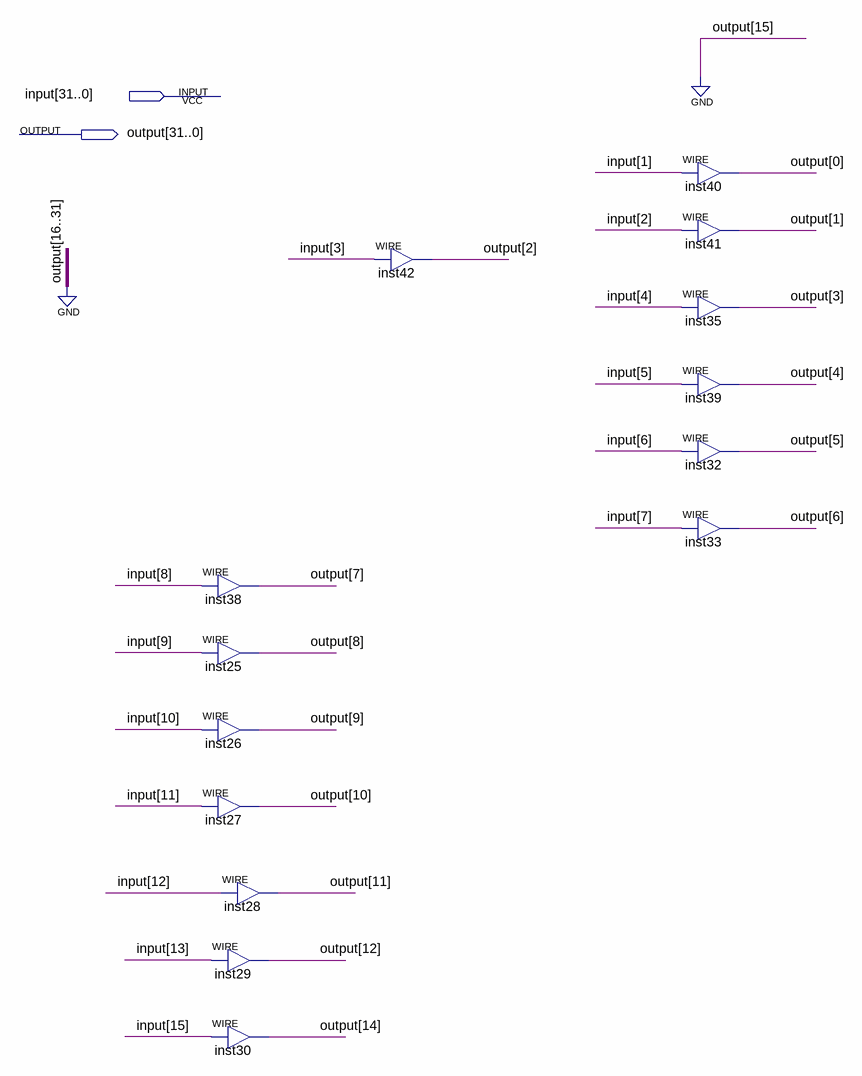
[diagram p0: schematic sheet]
// Quartus schematic 16-shiftR.bdf as structural Verilog: 14 symbols, 2 pins
module \16-shiftR  (
  input  [31:0] \input ,
  output [31:0] \output 
);

  assign \output [7] = \input [8];  // WIRE inst38
  assign \output [8] = \input [9];  // WIRE inst25
  assign \output [9] = \input [10];  // WIRE inst26
  assign \output [10] = \input [11];  // WIRE inst27
  assign \output [11] = \input [12];  // WIRE inst28
  assign \output [12] = \input [13];  // WIRE inst29
  assign \output [14] = \input [15];  // WIRE inst30
  assign \output [2] = \input [3];  // WIRE inst42
  assign \output [0] = \input [1];  // WIRE inst40
  assign \output [1] = \input [2];  // WIRE inst41
  assign \output [3] = \input [4];  // WIRE inst35
  assign \output [4] = \input [5];  // WIRE inst39
  assign \output [5] = \input [6];  // WIRE inst32
  assign \output [6] = \input [7];  // WIRE inst33

  assign \output [31:15] = {17{1'b0}};
endmodule
